# EAGLE design clock (EAGLE 8.0.0)
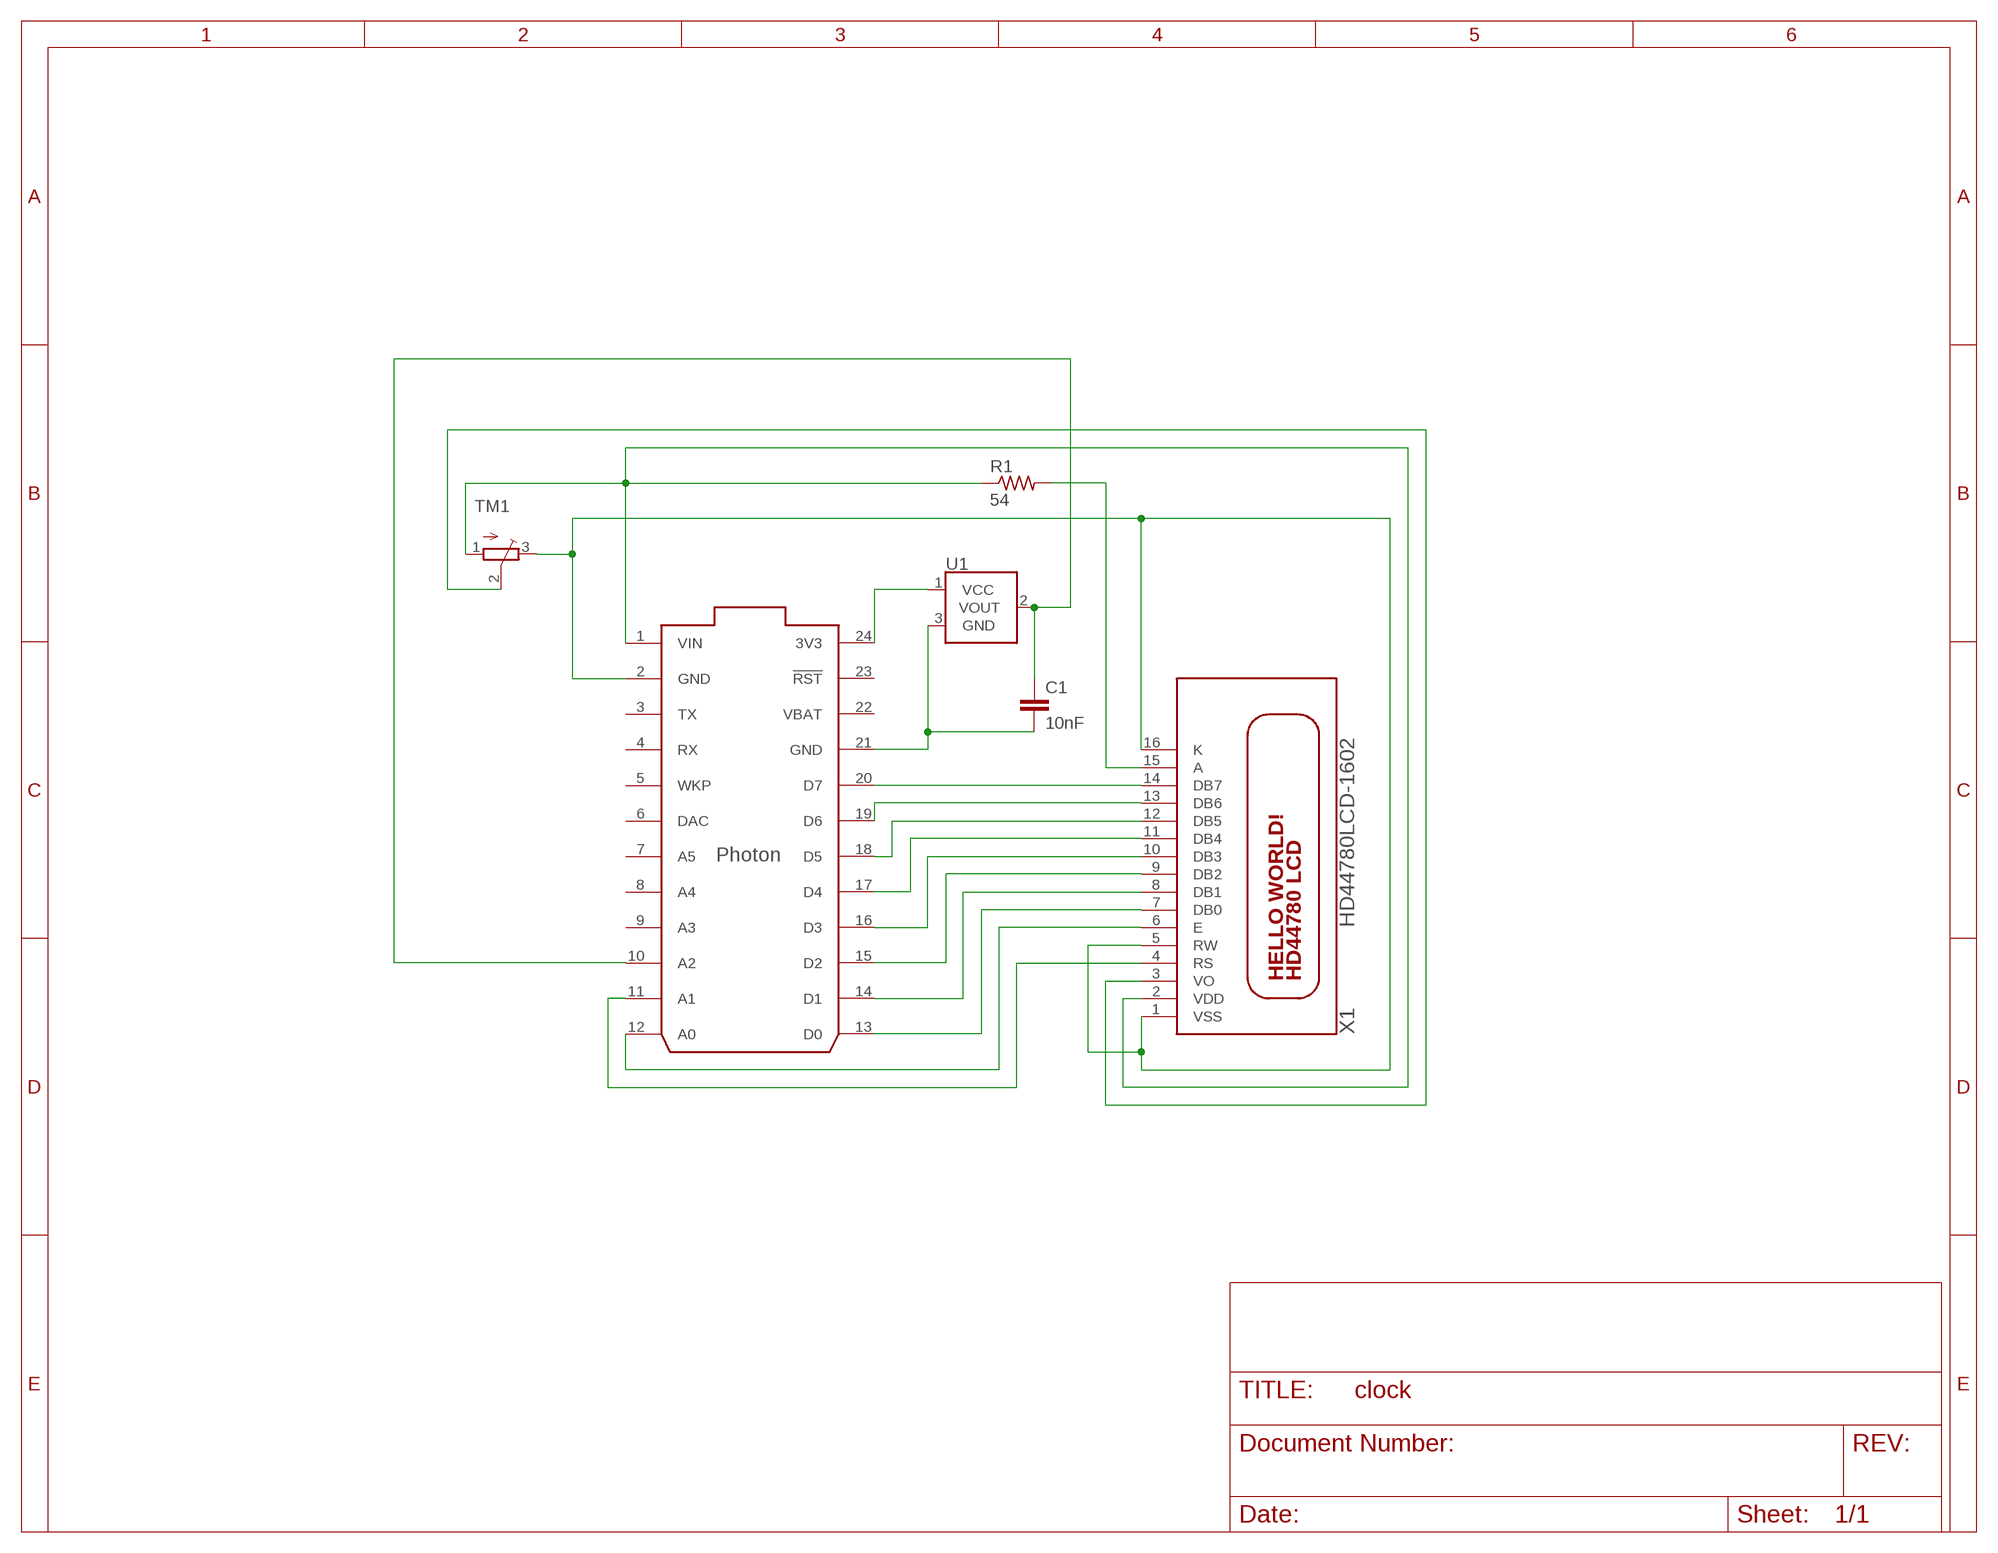
[diagram p0: schematic, sheet 1]

## Parts
C1  10nF  10NF-PTH-10MM-10000V-1-%  [CAP-PTH-10MM]
R1  54  R-US_0309/12  [0309/12]
TM1  TRIMPOT3386  [TRIM-3386]
U1  TMP36GT9  [TO-92]
U$1  PHOTON_WITH_HEADERS  [PHOTON]
X1  HD44780LCD-1602  [LCD1602]

## Nets
N$1: U$1.19(D6) X1.13(DB6)
N$2: C1.1 U1.2(VOUT) U$1.10(A2)
N$3: U$1.12(A0) X1.6(E)
N$4: U$1.18(D5) X1.12(DB5)
N$5: U$1.17(D4) X1.11(DB4)
N$6: U$1.20(D7) X1.14(DB7)
N$7: U$1.16(D3) X1.10(DB3)
N$8: U$1.15(D2) X1.9(DB2)
N$9: U$1.14(D1) X1.8(DB1)
N$10: U$1.13(D0) X1.7(DB0)
N$11: U$1.11(A1) X1.4(RS)
N$12: R1.2 X1.15(A)
N$13: TM1.2(S) X1.3(VO)
N$14: U1.1(VCC) U$1.24(3V3)
N$15: C1.2 U1.3(GND) U$1.21(GND)
VDD: R1.1 TM1.1(A) U$1.1(VIN) X1.2(VDD)
VSS: TM1.3(E) U$1.2(GND) X1.1(VSS) X1.5(RW) X1.16(K)
Unconnected: U$1.3(TX) U$1.4(RX) U$1.5(WKP) U$1.6(DAC) U$1.7(A5) U$1.8(A4) U$1.9(A3) U$1.23(!RST)

## Power pins joined to a net without a drawn wire
VBAT: U$1.22(VBAT)

## Library data of the parts
C1 = SparkFun-Capacitors:10NF: 0.01uF/10nF/10,000pF ceramic capacitors A capacitor is a passive two-terminal electrical component used to store electrical energy temporarily in an electric field. CAP-09321; PROD_ID: CAP-09321
R1 = adafruit:R-US_: RESISTOR, American symbol
TM1 = adafruit:TRIMPOT: SMT trimmer potentiometer part number TC33X http://www.ladyada.net/library/eagle
U1 = SparkFun-Sensors:TMP36: TMP36 Precision Analog °C Temperature Sensor The TMP36 is a low voltage, precision centigrade temperature sensor. It provides a voltage output that is linearly proportional to the Celsius temperature. It also doesn’t require any external calibration to provide typical accuracies of ±1°C at +25°C and ±2°C over the −40°C to +125°C temperature range. We like it because it’s so easy to use: Just give the device a ground and 2.7 to 5.5 VDC and read the voltage on the Vout pin. The output voltage can be converted to temperature easily using the scale factor of 10 mV/°C. Datasheet <http://cdn.sparkfun.com/datasheets/Sensors/Temp/TMP35_36_37.pdf> SparkFun Products Temperature Sensor - TMP36 <https://www.sparkfun.com/products/10988> (SEN-10988) SparkFun Danger Shield <https://www.sparkfun.com/products/11649> (DEV-11649); PROD_ID: IC-09880; SF_ID: SEN-10988
U$1 = Spark2:PHOTON
X1 = adafruit:HD44780LCD: HD44780 LCD Standard character type LCDs, available in sizes from 8x1 to 40x4!

## Board
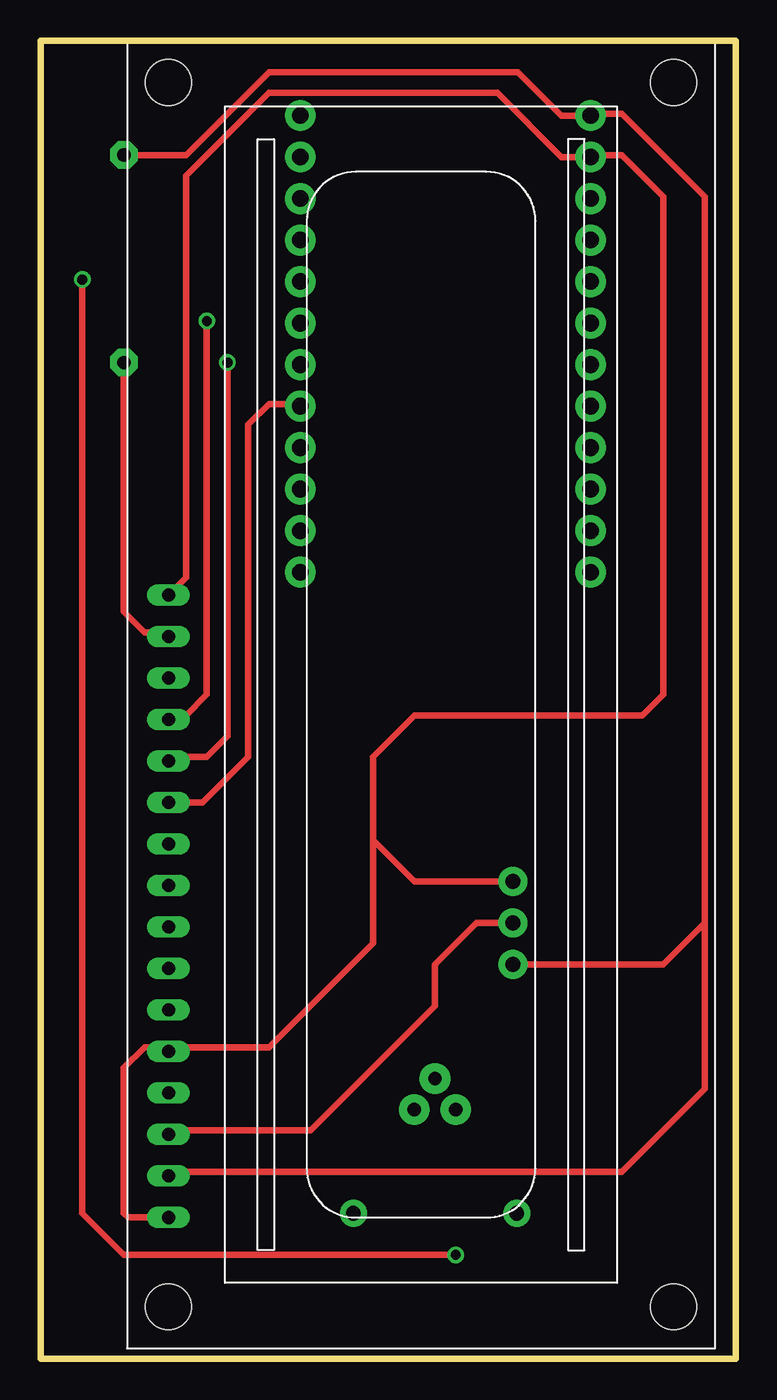
[diagram p1: board, top side]
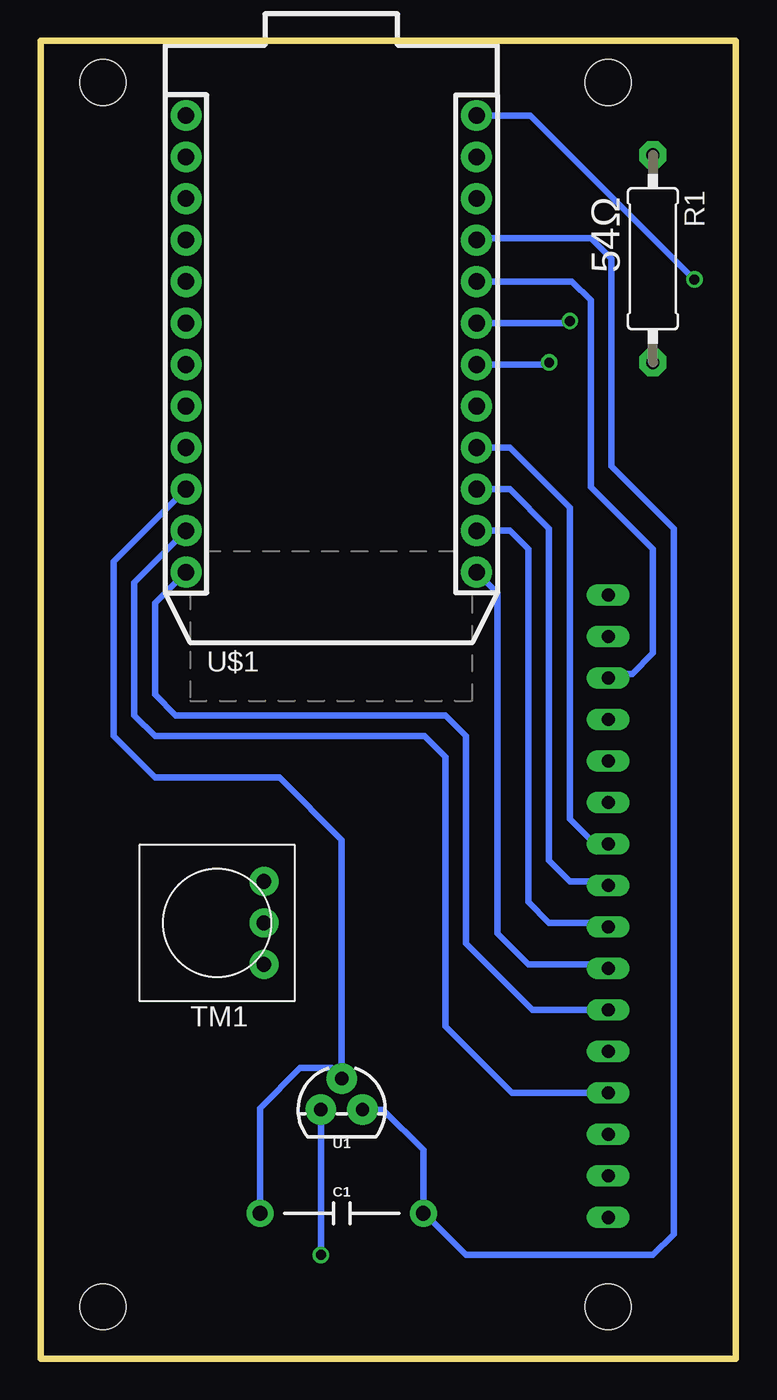
[diagram p2: board, bottom side, seen from below]

Size 42.55 x 80.65 mm. Coordinates in mm from the lower left corner, seen from the top.
Outline: 0,80.65 42.55,80.65 42.55,0 0,0 0,80.65
Copper layers (1*16): Top 0.035mm / dielectric 1.5mm / Bottom 0.035mm
Design rules "default *": minimum track width 10mil, minimum drill 13mil, track to track 8mil, track to pad 8mil, pad to pad 8mil, via to via 8mil, smd to smd 8mil, copper to edge 40mil, drill to drill 8mil, minimum pad ring 10mil, minimum via ring 8mil, stop-mask expansion 4mil, vias tented up to drill 0mil, thermal gap 10mil

### Footprints (pad centres in the part's own frame; a part is rotated, then mirrored left to right if it is on the bottom)
CAP-PTH-10MM = drill 0.9 pad 1.651: 1 -5,0; 2 5,0
0309/12 = drill 0.813 pad 1.676 octagon: 1 -6.35,0; 2 6.35,0
TRIM-3386 = drill 0.9 pad 1.778: 1 -2.54,-2.857; 2 0,-2.857; 3 2.54,-2.857
TO-92 = drill 0.813 pad 1.88: 1 -1.27,0; 2 0,1.905; 3 1.27,0
PHOTON = drill 1.016 pad 1.88: 1 1.27,32.258; 2 1.27,29.718; 3 1.27,27.178; 4 1.27,24.638; 5 1.27,22.098; 6 1.27,19.558; 7 1.27,17.018; 8 1.27,14.478; 9 1.27,11.938; 10 1.27,9.398; 11 1.27,6.858; 12 1.27,4.318; 13 19.05,4.318; 14 19.05,6.858; 15 19.05,9.398; 16 19.05,11.938; 17 19.05,14.478; 18 19.05,17.018; 19 19.05,19.558; 20 19.05,22.098; 21 19.05,24.638; 22 19.05,27.178; 23 19.05,29.718; 24 19.05,32.258
LCD1602 = drill 0.8 long: 1 8,33.46; 2 10.54,33.46; 3 13.08,33.46; 4 15.62,33.46; 5 18.16,33.46; 6 20.7,33.46; 7 23.24,33.46; 8 25.78,33.46; 9 28.32,33.46; 10 30.86,33.46; 11 33.4,33.46; 12 35.94,33.46; 13 38.48,33.46; 14 41.02,33.46; 15 43.56,33.46; 16 46.1,33.46 | hole 2.8: 2.54,2.54; 2.54,33.46; 77.46,33.46; 77.46,2.54

### Placement (x,y rotation side)
C1  24.13,8.89 0 bottom
R1  5.08,67.31 270 bottom
TM1  31.75,26.67 90 bottom
U1  24.13,15.24 0 bottom
U$1  34.92,43.81 0 bottom
X1  41.27,0.64 90 top

### Tracks (layer width: path | path; a pad name or v marks a point on that pad's centre or on a via)
N$1  (via drill 0.6)
  Top 0.406: v10.16,63.5 10.16,40.64 8.89,39.37 8.07,39.37 X1.13
  Bottom 0.406: U$1.19 10.29,63.37 v10.16,63.5
N$2
  Bottom 0.406: U$1.10 38.1,48.77 38.1,38.1 35.56,35.56 27.94,35.56 24.13,31.75 U1.2 24.77,17.78 26.67,17.78 29.13,15.32 C1.1
N$3
  Bottom 0.406: U$1.12 35.56,46.23 35.56,40.64 34.29,39.37 17.78,39.37 16.51,38.1 16.51,25.4 12.45,21.34 X1.6
N$4  (via drill 0.6)
  Top 0.406: v11.43,60.96 11.43,38.1 10.16,36.83 8.07,36.83 X1.12
  Bottom 0.406: U$1.18 11.56,60.83 v11.43,60.96
N$5
  Top 0.406: U$1.17 15.75,58.42 13.97,58.42 12.7,57.15 12.7,36.83 9.9,34.03 X1.11
N$6
  Bottom 0.406: U$1.20 10.03,65.91 8.89,64.77 8.89,53.34 5.08,49.53 5.08,43.18 6.35,41.91 7.56,41.91 X1.14
N$7
  Bottom 0.406: U$1.16 13.84,55.75 10.16,52.07 10.16,33.02 8.89,31.75 8.07,31.75 X1.10
N$8
  Bottom 0.406: U$1.15 13.84,53.21 11.43,50.8 11.43,30.48 10.16,29.21 8.07,29.21 X1.9
N$9
  Bottom 0.406: U$1.14 13.84,50.67 12.7,49.53 12.7,27.94 11.43,26.67 8.07,26.67 X1.8
N$10
  Bottom 0.406: X1.7 8.07,24.13 12.7,24.13 14.61,26.04 14.61,46.86 U$1.13
N$11
  Bottom 0.406: U$1.11 36.83,47.5 36.83,46.99 36.83,40.64 36.83,39.37 35.56,38.1 19.05,38.1 17.78,36.83 17.78,20.32 13.71,16.25 X1.4
N$12
  Top 0.406: R1.2 5.08,45.72 6.35,44.45 7.56,44.45 X1.15
N$13
  Top 0.406: TM1.2 26.67,26.67 24.13,24.13 24.13,21.59 16.51,13.97 8.07,13.97 X1.3
N$14  (via drill 0.6)
  Top 0.406: v25.4,6.35 5.08,6.35 2.54,8.89 v2.54,66.04
  Bottom 0.406: U1.1 v25.4,6.35 | v2.54,66.04 12.57,76.07 U$1.24
N$15
  Bottom 0.406: U$1.21 15.75,68.58 8.89,68.58 7.62,67.31 7.62,54.61 3.81,50.8 3.81,7.62 5.08,6.35 16.51,6.35 19.05,8.89 C1.2 19.13,12.78 21.59,15.24 U1.3
VDD
  Top 0.406: 40.64,26.67 38.1,24.13 TM1.1 | 40.64,26.67 40.64,71.12 35.56,76.2 33.78,76.2 U$1.1 31.88,76.07 29.21,78.74 13.97,78.74 8.89,73.66 R1.1 | 40.64,26.67 40.64,16.51 35.56,11.43 8.07,11.43 X1.2
VSS
  Top 0.406: 20.32,31.75 20.32,36.83 22.86,39.37 36.83,39.37 38.1,40.64 38.1,71.12 35.56,73.66 33.78,73.66 U$1.2 31.88,73.53 27.94,77.47 13.97,77.47 8.89,72.39 8.89,47.81 X1.16 | 20.32,31.75 22.86,29.21 TM1.3 | 20.32,31.75 20.32,25.4 13.97,19.05 8.07,19.05 X1.5 7.56,19.05 6.35,19.05 5.08,17.78 5.08,8.89 5.33,8.63 X1.1

### Text on the board
bPlace: 54Ω